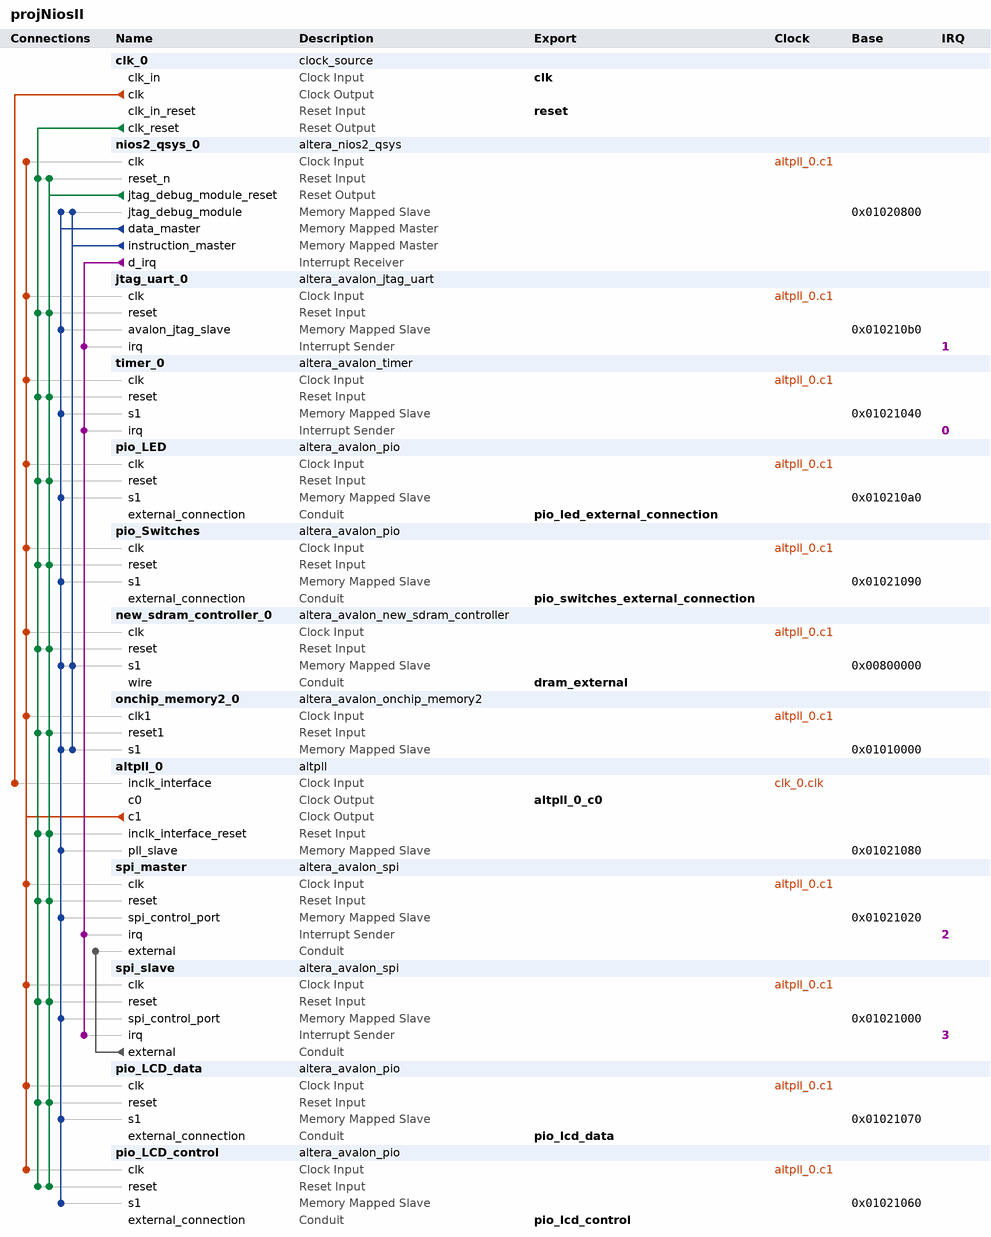
[diagram p0: system contents]
# Platform Designer (Qsys) system projNiosII, Cyclone III EP3C16F484C6
# Parameters at their usual value, and those the tool derives, are not listed.
package require -exact qsys 13.1
create_system projNiosII
set_project_property DEVICE_FAMILY {Cyclone III}
set_project_property DEVICE EP3C16F484C6

add_instance clk_0 clock_source 13.1
set_instance_parameter_value clk_0 clockFrequency 50000000

add_instance nios2_qsys_0 altera_nios2_qsys 13.1
set_instance_parameter_value nios2_qsys_0 resetSlave new_sdram_controller_0.s1
set_instance_parameter_value nios2_qsys_0 mmu_TLBMissExcSlave None
set_instance_parameter_value nios2_qsys_0 exceptionSlave new_sdram_controller_0.s1
set_instance_parameter_value nios2_qsys_0 breakSlave nios2_qsys_0.jtag_debug_module
set_instance_parameter_value nios2_qsys_0 impl Tiny
set_instance_parameter_value nios2_qsys_0 icache_size 4096

add_instance jtag_uart_0 altera_avalon_jtag_uart 13.1
set_instance_parameter_value jtag_uart_0 simInteractiveOptions NO_INTERACTIVE_WINDOWS

add_instance timer_0 altera_avalon_timer 13.1
set_instance_parameter_value timer_0 alwaysRun true
set_instance_parameter_value timer_0 fixedPeriod true
set_instance_parameter_value timer_0 period 10
set_instance_parameter_value timer_0 periodUnits MSEC
set_instance_parameter_value timer_0 snapshot false

add_instance pio_LED altera_avalon_pio 13.1
set_instance_parameter_value pio_LED direction Output
set_instance_parameter_value pio_LED width 8

add_instance pio_Switches altera_avalon_pio 13.1
set_instance_parameter_value pio_Switches direction Input
set_instance_parameter_value pio_Switches width 8

add_instance new_sdram_controller_0 altera_avalon_new_sdram_controller 13.1
set_instance_parameter_value new_sdram_controller_0 TAC 5.4
set_instance_parameter_value new_sdram_controller_0 TRCD 20.0
set_instance_parameter_value new_sdram_controller_0 TRP 20.0
set_instance_parameter_value new_sdram_controller_0 casLatency 2
set_instance_parameter_value new_sdram_controller_0 columnWidth 8
set_instance_parameter_value new_sdram_controller_0 dataWidth 16
set_instance_parameter_value new_sdram_controller_0 generateSimulationModel false
set_instance_parameter_value new_sdram_controller_0 model single_Micron_MT48LC4M32B2_7_chip
set_instance_parameter_value new_sdram_controller_0 numberOfBanks 4
set_instance_parameter_value new_sdram_controller_0 numberOfChipSelects 1
set_instance_parameter_value new_sdram_controller_0 powerUpDelay 100.0
set_instance_parameter_value new_sdram_controller_0 refreshPeriod 31.25
set_instance_parameter_value new_sdram_controller_0 rowWidth 12

add_instance onchip_memory2_0 altera_avalon_onchip_memory2 13.1
set_instance_parameter_value onchip_memory2_0 dataWidth 64
set_instance_parameter_value onchip_memory2_0 dualPort false
set_instance_parameter_value onchip_memory2_0 initMemContent true
set_instance_parameter_value onchip_memory2_0 initializationFileName onchip_mem.hex
set_instance_parameter_value onchip_memory2_0 memorySize 51200

add_instance altpll_0 altpll 13.1
set_instance_parameter_value altpll_0 INCLK0_INPUT_FREQUENCY 20000
set_instance_parameter_value altpll_0 CLK0_MULTIPLY_BY 1
set_instance_parameter_value altpll_0 CLK1_MULTIPLY_BY 1
set_instance_parameter_value altpll_0 CLK0_DIVIDE_BY 1
set_instance_parameter_value altpll_0 CLK1_DIVIDE_BY 1
set_instance_parameter_value altpll_0 CLK1_PHASE_SHIFT 3000
set_instance_parameter_value altpll_0 CLK1_DUTY_CYCLE 50
set_instance_parameter_value altpll_0 PORT_clk1 PORT_USED
set_instance_parameter_value altpll_0 PORT_clk2 PORT_UNUSED
set_instance_parameter_value altpll_0 PORT_clk3 PORT_UNUSED
set_instance_parameter_value altpll_0 PORT_ARESET PORT_USED
set_instance_parameter_value altpll_0 PORT_LOCKED PORT_USED

add_instance spi_master altera_avalon_spi 13.1
set_instance_parameter_value spi_master clockPolarity 0
set_instance_parameter_value spi_master dataWidth 8
set_instance_parameter_value spi_master masterSPI true
set_instance_parameter_value spi_master numberOfSlaves 1
set_instance_parameter_value spi_master targetClockRate 128000

add_instance spi_slave altera_avalon_spi 13.1
set_instance_parameter_value spi_slave clockPolarity 0
set_instance_parameter_value spi_slave dataWidth 8
set_instance_parameter_value spi_slave masterSPI false
set_instance_parameter_value spi_slave numberOfSlaves 1
set_instance_parameter_value spi_slave targetClockRate 128000

add_instance pio_LCD_data altera_avalon_pio 13.1
set_instance_parameter_value pio_LCD_data direction Output
set_instance_parameter_value pio_LCD_data width 8

add_instance pio_LCD_control altera_avalon_pio 13.1
set_instance_parameter_value pio_LCD_control direction Output
set_instance_parameter_value pio_LCD_control width 8

# connections
add_connection altpll_0.c1 jtag_uart_0.clk clock
add_connection altpll_0.c1 new_sdram_controller_0.clk clock
add_connection altpll_0.c1 nios2_qsys_0.clk clock
add_connection altpll_0.c1 onchip_memory2_0.clk1 clock
add_connection altpll_0.c1 pio_LCD_control.clk clock
add_connection altpll_0.c1 pio_LCD_data.clk clock
add_connection altpll_0.c1 pio_LED.clk clock
add_connection altpll_0.c1 pio_Switches.clk clock
add_connection altpll_0.c1 spi_master.clk clock
add_connection altpll_0.c1 spi_slave.clk clock
add_connection altpll_0.c1 timer_0.clk clock
add_connection clk_0.clk altpll_0.inclk_interface clock
add_connection clk_0.clk_reset altpll_0.inclk_interface_reset reset
add_connection clk_0.clk_reset jtag_uart_0.reset reset
add_connection clk_0.clk_reset new_sdram_controller_0.reset reset
add_connection clk_0.clk_reset nios2_qsys_0.reset_n reset
add_connection clk_0.clk_reset onchip_memory2_0.reset1 reset
add_connection clk_0.clk_reset pio_LCD_control.reset reset
add_connection clk_0.clk_reset pio_LCD_data.reset reset
add_connection clk_0.clk_reset pio_LED.reset reset
add_connection clk_0.clk_reset pio_Switches.reset reset
add_connection clk_0.clk_reset spi_master.reset reset
add_connection clk_0.clk_reset spi_slave.reset reset
add_connection clk_0.clk_reset timer_0.reset reset
add_connection nios2_qsys_0.jtag_debug_module_reset altpll_0.inclk_interface_reset reset
add_connection nios2_qsys_0.jtag_debug_module_reset jtag_uart_0.reset reset
add_connection nios2_qsys_0.jtag_debug_module_reset new_sdram_controller_0.reset reset
add_connection nios2_qsys_0.jtag_debug_module_reset nios2_qsys_0.reset_n reset
add_connection nios2_qsys_0.jtag_debug_module_reset onchip_memory2_0.reset1 reset
add_connection nios2_qsys_0.jtag_debug_module_reset pio_LCD_control.reset reset
add_connection nios2_qsys_0.jtag_debug_module_reset pio_LCD_data.reset reset
add_connection nios2_qsys_0.jtag_debug_module_reset pio_LED.reset reset
add_connection nios2_qsys_0.jtag_debug_module_reset pio_Switches.reset reset
add_connection nios2_qsys_0.jtag_debug_module_reset spi_master.reset reset
add_connection nios2_qsys_0.jtag_debug_module_reset spi_slave.reset reset
add_connection nios2_qsys_0.jtag_debug_module_reset timer_0.reset reset
add_connection nios2_qsys_0.data_master altpll_0.pll_slave avalon
set_connection_parameter_value nios2_qsys_0.data_master/altpll_0.pll_slave baseAddress 0x01021080
add_connection nios2_qsys_0.data_master jtag_uart_0.avalon_jtag_slave avalon
set_connection_parameter_value nios2_qsys_0.data_master/jtag_uart_0.avalon_jtag_slave baseAddress 0x010210b0
add_connection nios2_qsys_0.data_master new_sdram_controller_0.s1 avalon
set_connection_parameter_value nios2_qsys_0.data_master/new_sdram_controller_0.s1 baseAddress 0x00800000
add_connection nios2_qsys_0.data_master nios2_qsys_0.jtag_debug_module avalon
set_connection_parameter_value nios2_qsys_0.data_master/nios2_qsys_0.jtag_debug_module baseAddress 0x01020800
add_connection nios2_qsys_0.data_master onchip_memory2_0.s1 avalon
set_connection_parameter_value nios2_qsys_0.data_master/onchip_memory2_0.s1 baseAddress 0x01010000
add_connection nios2_qsys_0.data_master pio_LCD_control.s1 avalon
set_connection_parameter_value nios2_qsys_0.data_master/pio_LCD_control.s1 baseAddress 0x01021060
add_connection nios2_qsys_0.data_master pio_LCD_data.s1 avalon
set_connection_parameter_value nios2_qsys_0.data_master/pio_LCD_data.s1 baseAddress 0x01021070
add_connection nios2_qsys_0.data_master pio_LED.s1 avalon
set_connection_parameter_value nios2_qsys_0.data_master/pio_LED.s1 baseAddress 0x010210a0
add_connection nios2_qsys_0.data_master pio_Switches.s1 avalon
set_connection_parameter_value nios2_qsys_0.data_master/pio_Switches.s1 baseAddress 0x01021090
add_connection nios2_qsys_0.data_master spi_master.spi_control_port avalon
set_connection_parameter_value nios2_qsys_0.data_master/spi_master.spi_control_port baseAddress 0x01021020
add_connection nios2_qsys_0.data_master spi_slave.spi_control_port avalon
set_connection_parameter_value nios2_qsys_0.data_master/spi_slave.spi_control_port baseAddress 0x01021000
add_connection nios2_qsys_0.data_master timer_0.s1 avalon
set_connection_parameter_value nios2_qsys_0.data_master/timer_0.s1 baseAddress 0x01021040
add_connection nios2_qsys_0.instruction_master new_sdram_controller_0.s1 avalon
set_connection_parameter_value nios2_qsys_0.instruction_master/new_sdram_controller_0.s1 baseAddress 0x00800000
add_connection nios2_qsys_0.instruction_master nios2_qsys_0.jtag_debug_module avalon
set_connection_parameter_value nios2_qsys_0.instruction_master/nios2_qsys_0.jtag_debug_module baseAddress 0x01020800
add_connection nios2_qsys_0.instruction_master onchip_memory2_0.s1 avalon
set_connection_parameter_value nios2_qsys_0.instruction_master/onchip_memory2_0.s1 baseAddress 0x01010000
add_connection spi_slave.external spi_master.external conduit
add_connection nios2_qsys_0.d_irq jtag_uart_0.irq interrupt
set_connection_parameter_value nios2_qsys_0.d_irq/jtag_uart_0.irq irqNumber 1
add_connection nios2_qsys_0.d_irq spi_master.irq interrupt
set_connection_parameter_value nios2_qsys_0.d_irq/spi_master.irq irqNumber 2
add_connection nios2_qsys_0.d_irq spi_slave.irq interrupt
set_connection_parameter_value nios2_qsys_0.d_irq/spi_slave.irq irqNumber 3
add_connection nios2_qsys_0.d_irq timer_0.irq interrupt
set_connection_parameter_value nios2_qsys_0.d_irq/timer_0.irq irqNumber 0

# exported interfaces
add_interface clk clock sink
set_interface_property clk EXPORT_OF clk_0.clk_in
add_interface pio_switches_external_connection conduit end
set_interface_property pio_switches_external_connection EXPORT_OF pio_Switches.external_connection
add_interface pio_led_external_connection conduit end
set_interface_property pio_led_external_connection EXPORT_OF pio_LED.external_connection
add_interface dram_external conduit end
set_interface_property dram_external EXPORT_OF new_sdram_controller_0.wire
add_interface altpll_0_c0 clock source
set_interface_property altpll_0_c0 EXPORT_OF altpll_0.c0
add_interface reset reset sink
set_interface_property reset EXPORT_OF clk_0.clk_in_reset
add_interface pio_lcd_control conduit end
set_interface_property pio_lcd_control EXPORT_OF pio_LCD_control.external_connection
add_interface pio_lcd_data conduit end
set_interface_property pio_lcd_data EXPORT_OF pio_LCD_data.external_connection

set_interconnect_requirement {$system} qsys_mm.clockCrossingAdapter HANDSHAKE
set_interconnect_requirement {$system} qsys_mm.maxAdditionalLatency 1
set_interconnect_requirement {$system} qsys_mm.insertDefaultSlave false

save_system projNiosII.qsys
